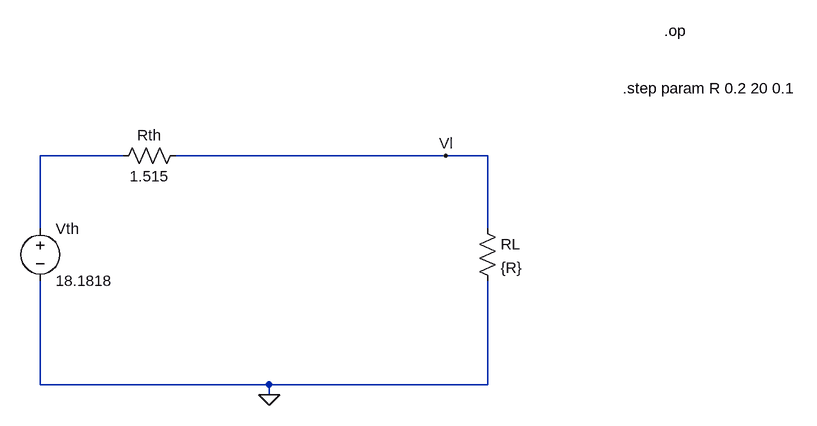
[diagram p0: schematic Schematic4.asc]
Schematic4.asc, the LTspice schematic file:
Version 4
SHEET 1 1052 680
WIRE -32 -112 -160 -112
WIRE 464 -112 48 -112
WIRE 528 -112 464 -112
WIRE -160 0 -160 -112
WIRE 528 0 528 -112
WIRE -160 240 -160 80
WIRE 192 240 -160 240
WIRE 528 240 528 80
WIRE 528 240 192 240
WIRE 192 256 192 240
FLAG 464 -112 Vl
FLAG 192 256 0
SYMBOL voltage -160 -16 R0
WINDOW 123 0 0 Left 0
WINDOW 39 0 0 Left 0
SYMATTR InstName Vth
SYMATTR Value 18.1818
SYMBOL res -48 -96 R270
WINDOW 0 32 56 VTop 2
WINDOW 3 0 56 VBottom 2
SYMATTR InstName Rth
SYMATTR Value 1.515
SYMBOL res 512 -16 R0
SYMATTR InstName RL
SYMATTR Value {R}
TEXT 736 -216 Left 2 !.step param R 0.2 20 0.1
TEXT 800 -304 Left 2 !.op

The netlist it stands for:
* Schematic4.asc
Vth N001 0 18.1818
Rth N001 Vl 1.515
RL Vl 0 {R}
.step param R 0.2 20 0.1
.op
.backanno
.end

* Results of the author's LTspice run, read from the files saved beside the schematic
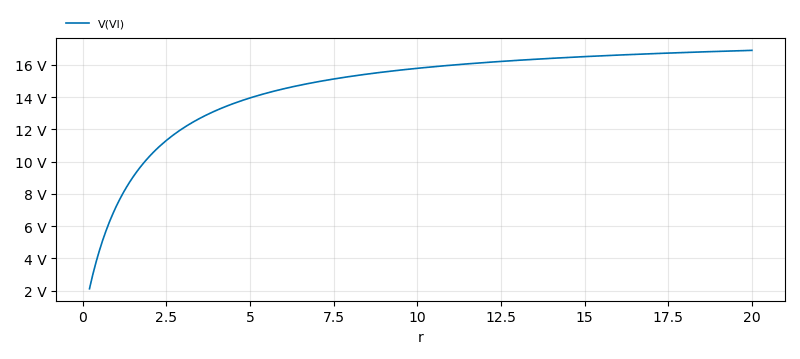
[diagram p1: Operating Point of Schematic4.asc, plotted from the saved traces]
* Operating Point, 1 run:
*   V(Vl): 2.12 V at r=200 m, 16.9 V at r=20 , min 2.12 V, max 16.9 V